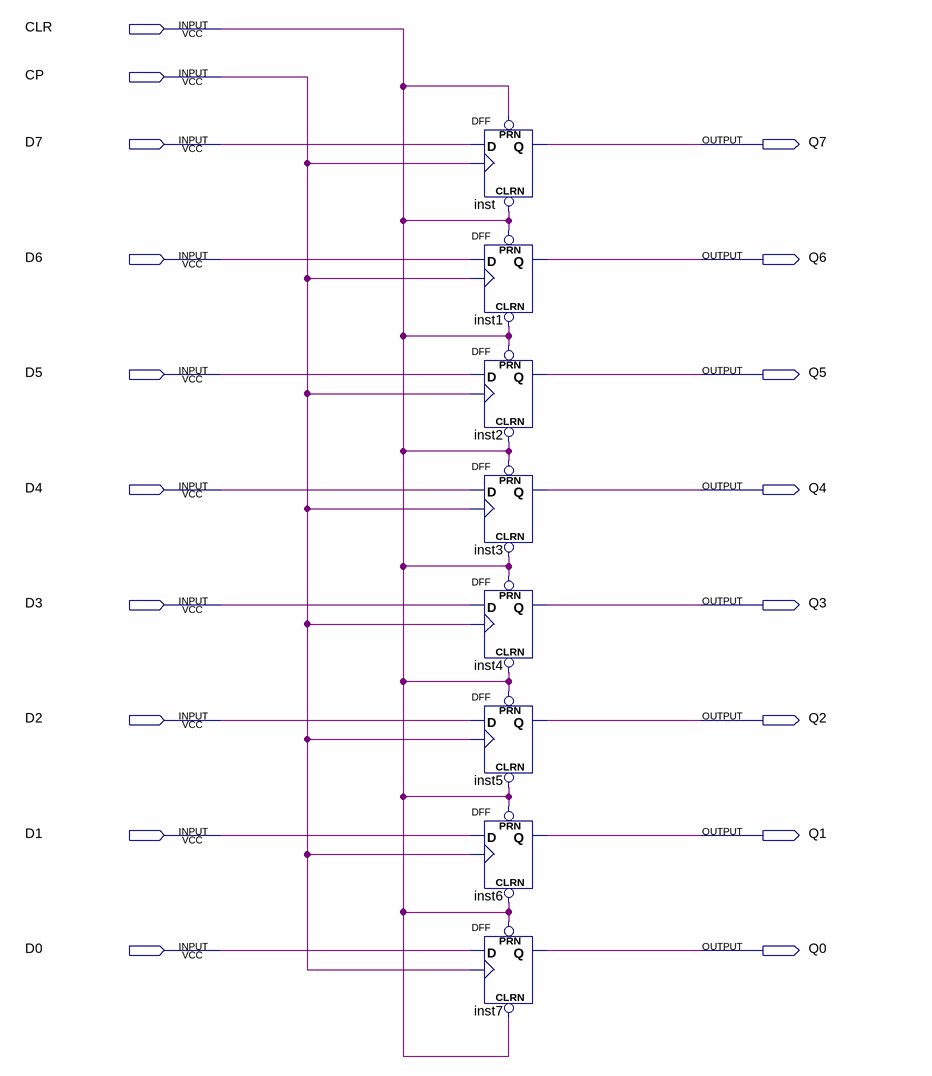
[diagram p0: schematic sheet]
// Quartus schematic MAR-8.bdf as structural Verilog: 8 symbols, 18 pins
module \MAR-8  (
  input  CLR,
  input  CP,
  input  D7,
  input  D6,
  input  D5,
  input  D4,
  input  D3,
  input  D2,
  input  D1,
  input  D0,
  output Q7,
  output Q6,
  output Q5,
  output Q4,
  output Q3,
  output Q2,
  output Q1,
  output Q0
);

  DFF inst (.CLRN(CLR), .CLK(CP), .D(D7), .PRN(CLR), .Q(Q7));
  DFF inst1 (.CLRN(CLR), .CLK(CP), .D(D6), .PRN(CLR), .Q(Q6));
  DFF inst2 (.CLRN(CLR), .CLK(CP), .D(D5), .PRN(CLR), .Q(Q5));
  DFF inst3 (.CLRN(CLR), .CLK(CP), .D(D4), .PRN(CLR), .Q(Q4));
  DFF inst4 (.CLRN(CLR), .CLK(CP), .D(D3), .PRN(CLR), .Q(Q3));
  DFF inst5 (.CLRN(CLR), .CLK(CP), .D(D2), .PRN(CLR), .Q(Q2));
  DFF inst6 (.CLRN(CLR), .CLK(CP), .D(D1), .PRN(CLR), .Q(Q1));
  DFF inst7 (.CLRN(CLR), .CLK(CP), .D(D0), .PRN(CLR), .Q(Q0));
endmodule
